# EAGLE schematic Amplifier+Mixer (EAGLE 9.3.0)
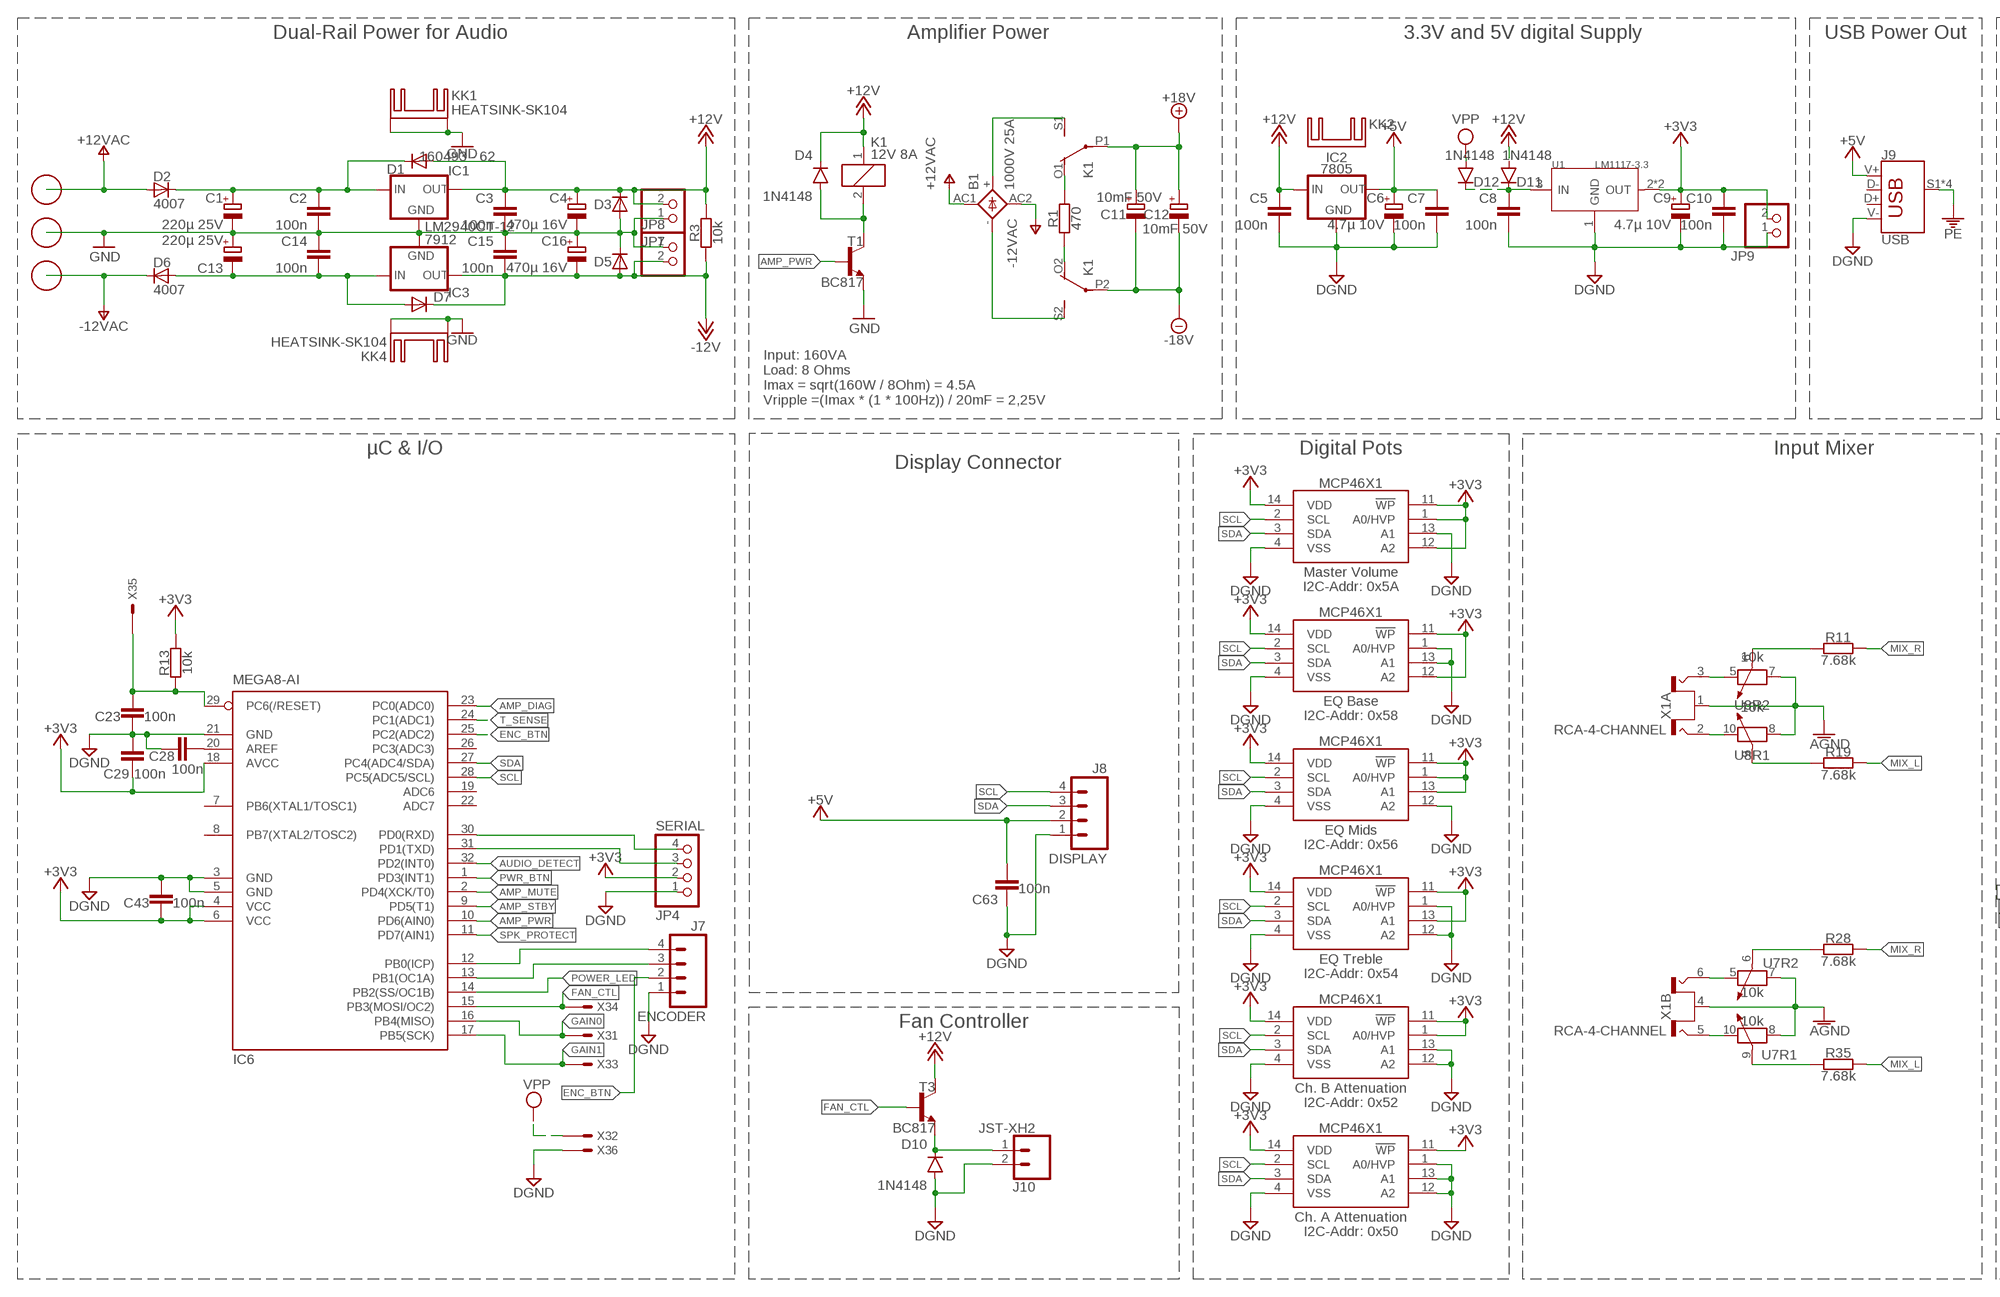
[diagram p0: schematic, sheet 1, part 1 of 2]
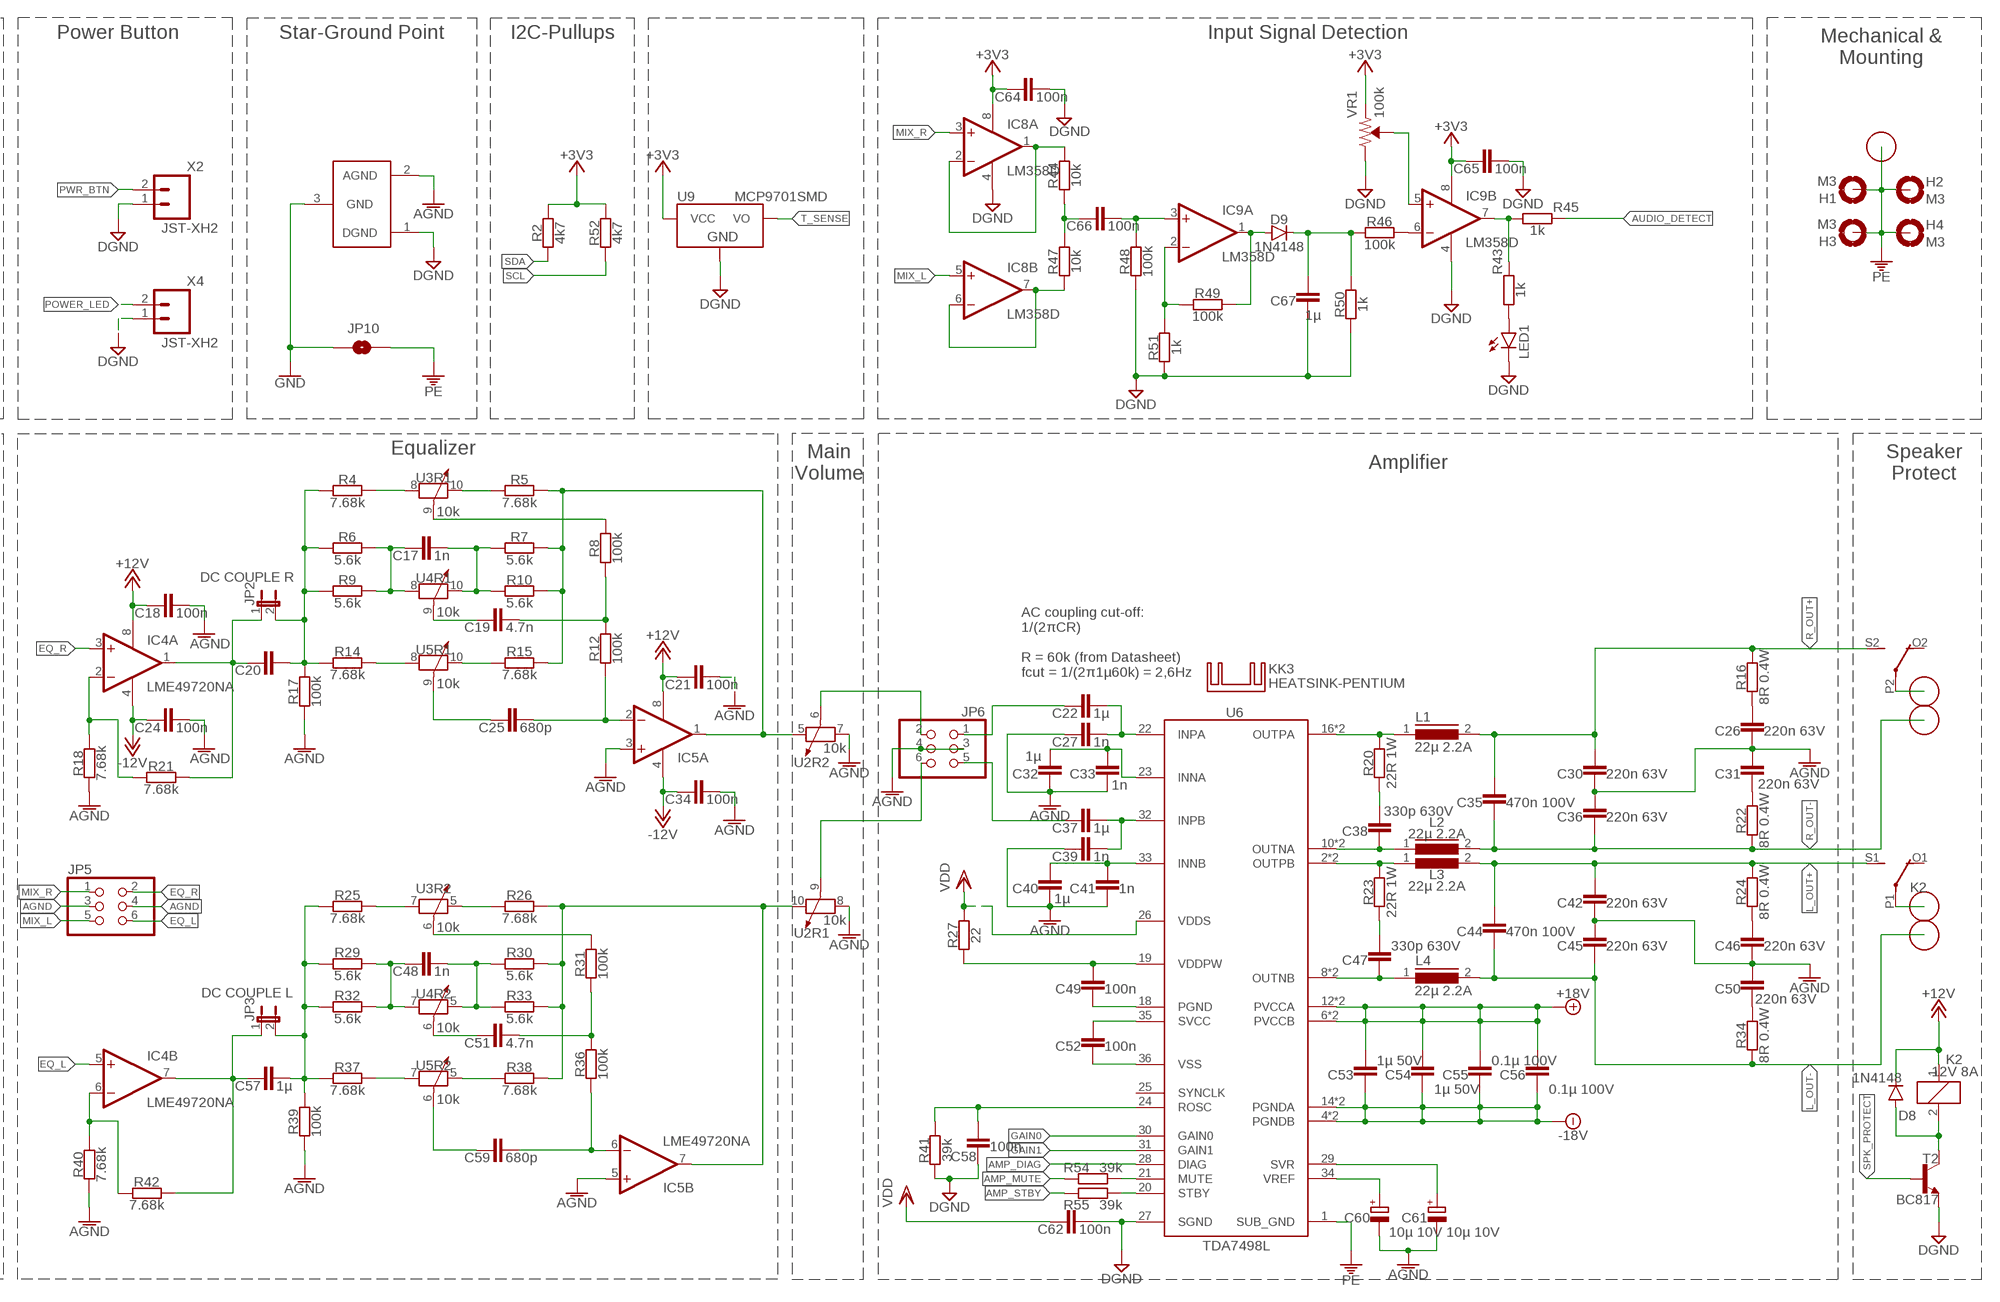
[diagram p1: schematic, sheet 1, part 2 of 2]

## Parts
B1  1000V 25A  RECTIFIER-FB100  [FB100]
C1  220µ 25V  CPOL-EU175TMP-0810  [175TMP-0810]
C2  100n  C-EUC0603  [C0603]
C3  100n  C-EUC0603  [C0603]
C4  470µ 16V  CPOL-EU175TMP-0810  [175TMP-0810]
C5  100n  C-EUC0603  [C0603]
C6  4.7µ 10V  CPOL-EU153CLV-0505  [153CLV-0505]
C7  100n  C-EUC0603  [C0603]
C8  100n  C-EUC0603  [C0603]
C9  4.7µ 10V  CPOL-EU153CLV-0505  [153CLV-0505]
C10  100n  C-EUC0603  [C0603]
C11  10mF 50V  TEAPO-SLG109M050S1A5T  [EB35D]
C12  10mF 50V  TEAPO-SLG109M050S1A5T  [EB35D]
C13  220µ 25V  CPOL-EU175TMP-0810  [175TMP-0810]
C14  100n  C-EUC0603  [C0603]
C15  100n  C-EUC0603  [C0603]
C16  470µ 16V  CPOL-EU175TMP-0810  [175TMP-0810]
C17  1n  C-EU050-025X075  [C050-025X075]
C18  100n  C-EUC0603  [C0603]
C19  4.7n  C-EU075-032X103  [C075-032X103]
C20  DC COUPLE L  C-EU050-050X075  [C050-050X075]
C21  100n  C-EUC0603  [C0603]
C22  1µ  C-EU050-050X075  [C050-050X075]
C23  100n  C-EUC0603  [C0603]
C24  100n  C-EUC0603  [C0603]
C25  680p  C-EU050-045X075  [C050-045X075]
C26  220n 63V  C-EU050-025X075  [C050-025X075]
C27  1n  C-EU050-025X075  [C050-025X075]
C28  100n  C-EUC0603  [C0603]
C29  100n  C-EUC0603  [C0603]
C30  220n 63V  C-EU050-025X075  [C050-025X075]
C31  220n 63V  C-EU050-025X075  [C050-025X075]
C32  1µ  C-EU050-050X075  [C050-050X075]
C33  1n  C-EU050-025X075  [C050-025X075]
C34  100n  C-EUC0603  [C0603]
C35  470n 100V  C-EU050-045X075  [C050-045X075]
C36  220n 63V  C-EU050-025X075  [C050-025X075]
C37  1µ  C-EU050-050X075  [C050-050X075]
C38  330p 630V  C-EU050-045X075  [C050-045X075]
C39  1n  C-EU050-025X075  [C050-025X075]
C40  1µ  C-EU050-050X075  [C050-050X075]
C41  1n  C-EU050-025X075  [C050-025X075]
C42  220n 63V  C-EU050-025X075  [C050-025X075]
C43  100n  C-EUC0603  [C0603]
C44  470n 100V  C-EU050-045X075  [C050-045X075]
C45  220n 63V  C-EU050-025X075  [C050-025X075]
C46  220n 63V  C-EU050-025X075  [C050-025X075]
C47  330p 630V  C-EU050-045X075  [C050-045X075]
C48  1n  C-EU050-025X075  [C050-025X075]
C49  100n  C-EUC0603  [C0603]
C50  220n 63V  C-EU050-025X075  [C050-025X075]
C51  4.7n  C-EU075-032X103  [C075-032X103]
C52  100n  C-EUC0603  [C0603]
C53  1µ 50V  C-EUC1206K  [C1206K]
C54  1µ 50V  C-EUC1206K  [C1206K]
C55  0.1µ 100V  C-EUC1206K  [C1206K]
C56  0.1µ 100V  C-EUC1206K  [C1206K]
C57  1µ  C-EU050-050X075  [C050-050X075]
C58  100n  C-EUC0603  [C0603]
C59  680p  C-EU050-045X075  [C050-045X075]
C60  10µ 10V  CPOL-EU153CLV-0505  [153CLV-0505]
C61  10µ 10V  CPOL-EU153CLV-0505  [153CLV-0505]
C62  100n  C-EUC0603  [C0603]
C63  100n  C-EUC0603  [C0603]
C64  100n  C-EUC0603  [C0603]
C65  100n  C-EUC0603  [C0603]
C66  100n  C-EUC0603  [C0603]
C67  1µ  C-EUC0603  [C0603]
D1  4007  DIODE  [SODFL5024X231]
D2  4007  DIODE  [SODFL5024X231]
D3  4007  DIODE  [SODFL5024X231]
D4  1N4148  DIODEBAS16  [SOD-323]
D5  4007  DIODE  [SODFL5024X231]
D6  4007  DIODE  [SODFL5024X231]
D7  4007  DIODE  [SODFL5024X231]
D8  1N4148  DIODEBAS16  [SOD-323]
D9  1N4148  DIODEBAS16  [SOD-323]
D10  1N4148  DIODEBAS16  [SOD-323]
D11  1N4148  DIODEBAS16  [SOD-323]
D12  1N4148  DIODEBAS16  [SOD-323]
H1  M3  HOLE-3MM-PAD  [3,0-PAD]
H2  M3  HOLE-3MM-PAD  [3,0-PAD]
H3  M3  HOLE-3MM-PAD  [3,0-PAD]
H4  M3  HOLE-3MM-PAD  [3,0-PAD]
IC1  LM2940CT-12  78XXS  [78XXS]
IC2  7805  78XXS  [78XXS]
IC3  7912  79XXS  [79XXS]
IC4  LME49720NA  LM358N  [DIL08]
IC5  LME49720NA  LM358N  [DIL08]
IC6  MEGA8-AI  [TQFP32-08]
IC8  LM358D  2AMP_P8+4D  [SO08]
IC9  LM358D  2AMP_P8+4D  [SO08]
J1  6MM  TERMINAL-1  [TE-726386]
J2  6MM  TERMINAL-1  [TE-726386]
J3  6MM  TERMINAL-1  [TE-726386]
J4  6MM  TERMINAL-1  [TE-726386]
J5  TERMINAL-BLOCK-2PLUG-IN  [MSTBV2]
J6  TERMINAL-BLOCK-2PLUG-IN  [MSTBV2]
J7  ENCODER  JST-XH4  [JST-4-PTH-VERT]
J8  DISPLAY  JST-XH4  [JST-4-PTH-VERT]
J9  USB  [ECON-USBBUVA]
J10  JST-XH2  [JST-2-PTH-VERT]
JP1  GND_CONNECT  [GND_CONNECT]
JP2  DC COULE R  JP1E  [JP1]
JP3  DC COUPLE L  JP1E  [JP1]
JP4  SERIAL  PINHD-1X4  [1X04]
JP5  MIX OUT  PINHD-2X3  [2X03]
JP6  PREAMP OUT  PINHD-2X3  [2X03]
JP7  PINHD-1X2  [1X02]
JP8  PINHD-1X2  [1X02]
JP9  PINHD-1X2  [1X02]
JP10  PEGND  JUMPER-SMT_2_NO_NO-SILK  [SMT-JUMPER_2_NO_NO-SILK]
K1  12V 8A  RELAY-F40.52  [F4052]
K2  12V 8A  RELAY-F40.52  [F4052]
KK1  HEATSINK-SK104  [SK104-PAD]
KK2  HEATSINK-SK95  [SK95-2M3]
KK3  HEATSINK-PENTIUM  [HEATSINK-PENTIUM]
KK4  HEATSINK-SK104  [SK104-PAD]
L1  22µ 2.2A  INDUCTOR12MM-SMD  [INDUCTOR-12MM]
L2  22µ 2.2A  INDUCTOR12MM-SMD  [INDUCTOR-12MM]
L3  22µ 2.2A  INDUCTOR12MM-SMD  [INDUCTOR-12MM]
L4  22µ 2.2A  INDUCTOR12MM-SMD  [INDUCTOR-12MM]
LED1  LEDCHIP-LED0603  [CHIP-LED0603]
R1  470  RESISTOR-0617-22  [0617/22]
R2  4k7  R-EU_R0603  [R0603]
R3  10k  R-EU_R0603  [R0603]
R4  7.68k  R-EU_MELF0207W  [MINI_MELF-0207W]
R5  7.68k  R-EU_MELF0207W  [MINI_MELF-0207W]
R6  5.6k  R-EU_MELF0207W  [MINI_MELF-0207W]
R7  5.6k  R-EU_MELF0207W  [MINI_MELF-0207W]
R8  100k  R-EU_MELF0204W  [MINI_MELF-0204W]
R9  5.6k  R-EU_MELF0207W  [MINI_MELF-0207W]
R10  5.6k  R-EU_MELF0207W  [MINI_MELF-0207W]
R11  7.68k  R-EU_MELF0207W  [MINI_MELF-0207W]
R12  100k  R-EU_MELF0204W  [MINI_MELF-0204W]
R13  10k  R-EU_R0603  [R0603]
R14  7.68k  R-EU_MELF0207W  [MINI_MELF-0207W]
R15  7.68k  R-EU_MELF0207W  [MINI_MELF-0207W]
R16  8R 0.4W  R-EU_MELF0204W  [MINI_MELF-0204W]
R17  100k  R-EU_MELF0204W  [MINI_MELF-0204W]
R18  7.68k  R-EU_MELF0207W  [MINI_MELF-0207W]
R19  7.68k  R-EU_MELF0207W  [MINI_MELF-0207W]
R20  22R 1W  R-EU_MELF0207W  [MINI_MELF-0207W]
R21  7.68k  R-EU_MELF0207W  [MINI_MELF-0207W]
R22  8R 0.4W  R-EU_MELF0204W  [MINI_MELF-0204W]
R23  22R 1W  R-EU_MELF0207W  [MINI_MELF-0207W]
R24  8R 0.4W  R-EU_MELF0204W  [MINI_MELF-0204W]
R25  7.68k  R-EU_MELF0207W  [MINI_MELF-0207W]
R26  7.68k  R-EU_MELF0207W  [MINI_MELF-0207W]
R27  22  R-EU_R0603  [R0603]
R28  7.68k  R-EU_MELF0207W  [MINI_MELF-0207W]
R29  5.6k  R-EU_MELF0207W  [MINI_MELF-0207W]
R30  5.6k  R-EU_MELF0207W  [MINI_MELF-0207W]
R31  100k  R-EU_MELF0204W  [MINI_MELF-0204W]
R32  5.6k  R-EU_MELF0207W  [MINI_MELF-0207W]
R33  5.6k  R-EU_MELF0207W  [MINI_MELF-0207W]
R34  8R 0.4W  R-EU_MELF0204W  [MINI_MELF-0204W]
R35  7.68k  R-EU_MELF0207W  [MINI_MELF-0207W]
R36  100k  R-EU_MELF0204W  [MINI_MELF-0204W]
R37  7.68k  R-EU_MELF0207W  [MINI_MELF-0207W]
R38  7.68k  R-EU_MELF0207W  [MINI_MELF-0207W]
R39  100k  R-EU_MELF0204W  [MINI_MELF-0204W]
R40  7.68k  R-EU_MELF0207W  [MINI_MELF-0207W]
R41  39k  R-EU_R0603  [R0603]
R42  7.68k  R-EU_MELF0207W  [MINI_MELF-0207W]
R43  1k  R-EU_R0603  [R0603]
R44  10k  R-EU_R0603  [R0603]
R45  1k  R-EU_R0603  [R0603]
R46  100k  R-EU_R0603  [R0603]
R47  10k  R-EU_R0603  [R0603]
R48  100k  R-EU_R0603  [R0603]
R49  100k  R-EU_R0603  [R0603]
R50  1k  R-EU_R0603  [R0603]
R51  1k  R-EU_R0603  [R0603]
R52  4k7  R-EU_R0603  [R0603]
R54  39k  R-EU_R0603  [R0603]
R55  39k  R-EU_R0603  [R0603]
T1  BC817  BC817-16-NPN-SOT23-BEC  [SOT23-BEC]
T2  BC817  BC817-16-NPN-SOT23-BEC  [SOT23-BEC]
T3  BC817  BC817-16-NPN-SOT23-BEC  [SOT23-BEC]
U1  LM1117-3.3  PMIC-CJT1117-3.3(SOT223)  [SOT-223]
U2  10k  MCP46X1  [SOP65P640X120-14]
U3  10k  MCP46X1  [SOP65P640X120-14]
U4  10k  MCP46X1  [SOP65P640X120-14]
U5  10k  MCP46X1  [SOP65P640X120-14]
U6  TDA7498L  [SOP50P1010X245-36]
U7  10k  MCP46X1  [SOP65P640X120-14]
U8  10k  MCP46X1  [SOP65P640X120-14]
U9  MCP9701SMD  MCP9700SMD  [SOT23-3]
VR1  100k  TRIMPOT-SMD-3MM-OPEN-1/10W-25%  [TRIMPOT-SMD-TC33X]
X1  RCA-4-CHANNEL  [BKL-072385]
X2  JST-XH2  [JST-2-PTH-VERT]
X3  ICSP  CONN-IDC-6  [057-006-1]
X4  JST-XH2  [JST-2-PTH-VERT]

## Nets
+3V3: C9.+ C10.1 C29.1 C43.1 C64.1 C65.1 IC6.4(VCC) IC6.6(VCC) IC6.18(AVCC) IC8.8(P:V+) IC9.8(P:V+) JP4.2 JP9.2 R2.2 R13.2 R52.2 U1.2(OUT) U1.TER(OUT) U2.1(A0/HVP) U2.11(!WP) U2.12(A2) U2.14(VDD) U3.11(!WP) U3.12(A2) U3.14(VDD) U4.1(A0/HVP) U4.11(!WP) U4.13(A1) U4.14(VDD) U5.11(!WP) U5.13(A1) U5.14(VDD) U7.1(A0/HVP) U7.11(!WP) U7.14(VDD) U8.11(!WP) U8.14(VDD) U9.1(VCC) VR1.3(CCW)
+5V: C6.+ C7.1 C63.2 IC2.OUT J8.2 J9.V+(VBUS)
+12V: C3.1 C4.+ C5.1 C18.1 C21.1 D1.A D3.C D4.C D8.C D11.A IC1.OUT IC2.IN IC4.8(P:V+) IC5.8(P:V+) JP7.2 K1.1 K2.1 R3.1 T3.C
+18V: C11.+ C12.+ C53.1 C54.1 C55.1 C56.1 K1.P1(SW1:P) U6.6(PVCCB) U6.7(PVCCB) U6.12(PVCCA) U6.13(PVCCA)
-12V: C15.2 C16.- C24.1 C34.1 D5.A D7.C IC3.OUT IC4.4(P:V-) IC5.4(P:V-) JP8.2 R3.2
-18V: C11.- C12.- C53.2 C54.2 C55.2 C56.2 K1.P2(SW2:P) U6.4(PGNDB) U6.5(PGNDB) U6.14(PGNDA) U6.15(PGNDA)
AGND: C18.2 C21.2 C24.2 C26.2 C27.1 C30.2 C31.1 C32.1 C33.1 C34.2 C36.1 C39.1 C40.1 C41.1 C42.2 C45.1 C46.2 C50.1 C60.- C61.- IC5.3(A:+IN) IC5.5(B:+IN) JP1.2(AGND) JP5.3 JP5.4 JP6.3 JP6.4 R17.1 R18.2 R39.1 R40.2 U2.7(R2:A) U2.8(R1:A) U7.7(R2:A) U7.8(R1:A) U8.7(R2:A) U8.8(R1:A) X1.1(A:S) X1.4(B:S)
AMP_DIAG: IC6.23(PC0(ADC0)) U6.28(DIAG)
AMP_MUTE: IC6.2(PD4(XCK/T0)) R54.2
AMP_MUTE_CL: R54.1 U6.21(MUTE)
AMP_PWR: IC6.10(PD6(AIN0)) T1.B
AMP_STBY: IC6.9(PD5(T1)) R55.2
AMP_STBY_CL: R55.1 U6.20(STBY)
AUDIO_DETECT: IC6.32(PD2(INT0)) R45.1
DGND: C5.2 C6.- C7.2 C8.2 C9.- C10.2 C23.1 C28.2 C29.2 C43.2 C58.2 C62.1 C63.1 C64.2 C65.2 C67.1 D10.A IC2.GND IC6.3(GND) IC6.5(GND) IC6.21(GND) IC8.4(P:V-) IC9.4(P:V-) J7.1 J8.1 J9.V-(GND) J10.2 JP1.1(DGND) JP4.1 JP9.1 LED1.C R41.1 R48.1 R50.1 R51.1 T2.E U1.1(GND) U2.4(VSS) U2.13(A1) U3.1(A0/HVP) U3.4(VSS) U3.13(A1) U4.4(VSS) U4.12(A2) U5.1(A0/HVP) U5.4(VSS) U5.12(A2) U6.27(SGND) U7.4(VSS) U7.12(A2) U7.13(A1) U8.1(A0/HVP) U8.4(VSS) U8.12(A2) U8.13(A1) U9.3(GND) VR1.1(CW) X2.1 X3.6 X4.1
ENC_BTN: IC6.25(PC2(ADC2)) J7.2
EQ_L: IC4.5(B:+IN) JP5.6
EQ_OUT_L: IC5.7(B:OUT) R26.1 R30.1 R33.1 R38.1 U2.10(R1:B)
EQ_OUT_R: IC5.1(A:OUT) R5.1 R7.1 R10.1 R15.1 U2.5(R2:B)
EQ_R: IC4.3(A:+IN) JP5.2
FAN_CTL: IC6.15(PB3(MOSI/OC2)) T3.B X3.4
GAIN0: IC6.16(PB4(MISO)) U6.30(GAIN0) X3.1
GAIN1: IC6.17(PB5(SCK)) U6.31(GAIN1) X3.3
GND: C1.- C2.2 C3.2 C4.- C13.+ C14.1 C15.1 C16.+ D3.A D5.C IC1.GND IC3.GND J2.P$1 J2.P$2 JP1.3(GND) JP7.1 JP8.1 JP10.1 KK1.K1(K) KK1.K2(K) KK4.K1(K) KK4.K2(K) T1.E
INNA: C32.2 C33.2 U6.23(INNA)
INNB: C40.2 C41.2 U6.33(INNB)
INPA: C22.2 C27.2 U6.22(INPA)
INPB: C37.2 C39.2 U6.32(INPB)
L_OUT+: C42.1 C44.1 K2.S1(SW1:S) L3.2 R24.2
L_OUT-: C44.2 C45.2 J6.1 L4.2 R34.1
MIX_AMP_L: C57.1 IC4.7(B:OUT) JP3.1 R42.1
MIX_AMP_R: C20.1 IC4.1(A:OUT) JP2.1 R21.1
MIX_L: IC8.5(B:+IN) JP5.5 R19.2 R35.2
MIX_R: IC8.3(A:+IN) JP5.1 R11.2 R28.2
N$1: C20.2 JP2.2 R4.2 R6.2 R9.2 R14.2 R17.2
N$2: R14.1 U5.8(R1:A)
N$3: C25.2 U5.9(R1:W)
N$4: R15.2 U5.10(R1:B)
N$5: C17.1 R6.1 R9.1 U4.8(R1:A)
N$6: C57.2 JP3.2 R25.2 R29.2 R32.2 R37.2 R39.2
N$7: R8.2 U3.9(R1:W)
N$8: R31.2 U3.6(R2:W)
N$9: B1.+ K1.S1(SW1:S)
N$10: R26.2 U3.5(R2:B)
N$11: C19.2 U4.9(R1:W)
N$12: C19.1 R8.1 R12.2
N$13: C66.1 R44.1 R47.2
N$14: R25.1 U3.7(R2:A)
N$15: C17.2 R7.2 R10.2 U4.10(R1:B)
N$16: C59.2 U5.6(R2:W)
N$17: C51.2 U4.6(R2:W)
N$18: R4.1 U3.8(R1:A)
N$19: C48.1 R29.1 R32.1 U4.7(R2:A)
N$20: C48.2 R30.2 R33.2 U4.5(R2:B)
N$21: R37.1 U5.7(R2:A)
N$22: R38.2 U5.5(R2:B)
N$23: C13.- C14.2 D6.A D7.A IC3.IN
N$24: C1.+ C2.1 D1.C D2.C IC1.IN
N$25: C66.2 IC9.3(A:+IN) R48.2
N$26: C52.2 U6.36(VSS)
N$27: B1.- K1.S2(SW2:S)
N$28: R5.2 U3.10(R1:B)
N$29: C51.1 R31.1 R36.2
N$30: C52.1 U6.35(SVCC)
N$31: IC9.2(A:-IN) R49.2 R51.2
N$32: D9.A IC9.1(A:OUT) R49.1
N$33: C67.2 D9.C R46.2 R50.2
N$34: IC9.6(B:-IN) R46.1
N$35: IC9.5(B:+IN) VR1.2(WIPER)
N$36: IC9.7(B:OUT) R43.1 R45.2
N$37: LED1.A R43.2
N$38: IC8.6(B:-IN) IC8.7(B:OUT) R47.1
N$39: IC8.1(A:OUT) IC8.2(A:-IN) R44.2
N$40: U7.5(R2:B) X1.6(B:T2)
N$41: U7.10(R1:B) X1.5(B:T1)
N$42: R35.1 U7.9(R1:W)
N$43: R28.1 U7.6(R2:W)
N$44: IC4.6(B:-IN) R40.1 R42.2
N$45: IC4.2(A:-IN) R18.1 R21.2
N$46: U8.5(R2:B) X1.3(A:T2)
N$47: U8.10(R1:B) X1.2(A:T1)
N$48: R19.1 U8.9(R1:W)
N$49: R11.1 U8.6(R2:W)
N$50: D4.A K1.2 T1.C
N$51: J6.2 K2.P1(SW1:P)
N$53: K1.O1(SW1:O) R1.1
N$54: C58.1 R41.2 U6.24(ROSC)
N$55: C49.1 R27.1 U6.19(VDDPW)
N$56: C49.2 U6.18(PGND)
N$57: C8.1 D11.C D12.C U1.3(IN)
N$59: K1.O2(SW2:O) R1.2
N$61: J5.1 K2.P2(SW2:P)
N$62: C50.2 R34.2
N$63: D10.C J10.1 T3.E
N$64: C46.1 R24.1
N$65: C60.+ U6.34(VREF)
N$66: C61.+ U6.29(SVR)
N$67: C31.2 R22.2
N$68: C26.1 R16.1
N$69: C47.2 L4.1 U6.8(OUTNB) U6.9(OUTNB)
N$70: C38.2 L2.1 U6.10(OUTNA) U6.11(OUTNA)
N$71: C38.1 R20.1
N$72: C47.1 R23.1
N$73: L1.1 R20.2 U6.16(OUTPA) U6.17(OUTPA)
N$74: L3.1 R23.2 U6.2(OUTPB) U6.3(OUTPB)
N$75: D8.A K2.2 T2.C
N$76: IC6.13(PB1(OC1A)) J7.3
N$77: C28.1 IC6.20(AREF)
N$78: IC6.12(PB0(ICP)) J7.4
N$81: C22.1 JP6.1
N$82: C23.2 IC6.29(PC6(/RESET)) R13.1 X3.5
N$84: C37.1 JP6.5
N$85: IC6.30(PD0(RXD)) JP4.4
N$86: IC6.31(PD1(TXD)) JP4.3
OUT_L_DAMPED: C59.1 IC5.6(B:-IN) R36.1
OUT_R_DAMPED: C25.1 IC5.2(A:-IN) R12.1
PE: H1.B3,0(MOUNT) H2.B3,0(MOUNT) H3.B3,0(MOUNT) H4.B3,0(MOUNT) J4.P$1 J4.P$2 J9.S1(SHIELD) J9.S2(SHIELD) J9.S3(SHIELD) J9.S4(SHIELD) JP10.2 U6.1(SUB_GND)
POWER_LED: IC6.14(PB2(SS/OC1B)) X4.2
PREAMP_OUT_L: JP6.6 U2.9(R1:W)
PREAMP_OUT_R: JP6.2 U2.6(R2:W)
PWR_BTN: IC6.1(PD3(INT1)) X2.2
R_OUT+: C30.1 C35.1 K2.S2(SW2:S) L1.2 R16.2
R_OUT-: C35.2 C36.2 J5.2 L2.2 R22.1
SCL: IC6.28(PC5(ADC5/SCL)) J8.4 R52.1 U2.2(SCL) U3.2(SCL) U4.2(SCL) U5.2(SCL) U7.2(SCL) U8.2(SCL)
SDA: IC6.27(PC4(ADC4/SDA)) J8.3 R2.1 U2.3(SDA) U3.3(SDA) U4.3(SDA) U5.3(SDA) U7.3(SDA) U8.3(SDA)
SPK_PROTECT: IC6.11(PD7(AIN1)) T2.B
T_SENSE: IC6.24(PC1(ADC1)) U9.2(VO)
V+: B1.AC1 D2.A J1.P$1 J1.P$2 ; supply symbol labelled +12VAC
V-: B1.AC2 D6.C J3.P$1 J3.P$2 ; supply symbol labelled -12VAC
VDD: C62.2 R27.2 U6.26(VDDS)
VPP: D12.A X3.2
Unconnected: IC6.7(PB6(XTAL1/TOSC1)) IC6.8(PB7(XTAL2/TOSC2)) IC6.19(ADC6) IC6.22(ADC7) IC6.26(PC3(ADC3)) J9.D+ J9.D- K2.O1(SW1:O) K2.O2(SW2:O) U6.25(SYNCLK)

## Notes on the sheet
- Dual-Rail Power for Audio | Amplifier Power | 3.3V and 5V digital Supply | USB Power Out | Power Button | Star-Ground Point | I2C-Pullups | Input Signal Detection
- Mechanical &
  Mounting
- Input: 160VA
  Load: 8 Ohms
  Imax = sqrt(160W / 8Ohm) = 4.5A
  Vripple =(Imax * (1 * 100Hz)) / 20mF = 2,25V
- µC & I/O | Digital Pots | Input Mixer | Equalizer
- Display Connector
- Main
  Volume
- Amplifier
- Speaker
  Protect
- Master Volume | DC COUPLE R
- I2C-Addr: 0x5A
- AC coupling cut-off:
  1/(2πCR)
  
  R = 60k (from Datasheet)
  fcut = 1/(2π1µ60k) = 2,6Hz
- EQ Base
- I2C-Addr: 0x58
- EQ Mids
- I2C-Addr: 0x56
- EQ Treble
- I2C-Addr: 0x54
- DC COUPLE L
- Fan Controller
- Ch. B Attenuation
- I2C-Addr: 0x52
- Ch. A Attenuation
- I2C-Addr: 0x50

## Library data of the parts
B1 = Class D Amp:RECTIFIER-FB100; CONRAD: 1582009 - 62; MOUSER: 833-GBJL2510-BP; SPEC: TC-GBI25M; STOCK: 0
C1 C13 = rcl:CPOL-EU: POLARIZED CAPACITOR, European symbol; CONRAD: 404629 - 62; MOUSER: 647-UWT1E221MNL1GS; SPICEPREFIX: C; STOCK: 2
C2 C3 C5 C7 C8 C10 C14 C15 C18 C21 C23 C24 C28 C29 C34 C43 C49 C52 C58 C62-C66 = rcl:C-EU: CAPACITOR, European symbol; CONRAD: 457901 - 62; MOUSER: 710-885012206071; SPICEPREFIX: C; STOCK: 24
C4 C16 = rcl:CPOL-EU: POLARIZED CAPACITOR, European symbol; CONRAD: 404626 - 62; MOUSER: 647-UWT1C471MNL1S; SPICEPREFIX: C; STOCK: 2
C6 C9 = rcl:CPOL-EU: POLARIZED CAPACITOR, European symbol; CONRAD: 1280266 - 62; MOUSER: 710-865230642008; SPICEPREFIX: C; STOCK: 2
C11 C12 = Class D Amp:TEAPO-SLG109M050S1A5T; CONRAD: 1325816 - 62; MOUSER: 647-LLS1H103MELC; SPEC: Teapo SLG109M050S1A5T40K; STOCK: 0
C17 C27 C33 C39 C41 C48 = rcl:C-EU: CAPACITOR, European symbol; CONRAD: 1235242 - 62; MOUSER: 80-R82EC1100AA50K; SPEC: Kemet R82EC1100AA50K+; SPICEPREFIX: C; STOCK: 0
C19 C51 = rcl:C-EU: CAPACITOR, European symbol; CONRAD: 459871 - 62; MOUSER: 594-222237188472; SPEC: Wima FKS3D014702B00KSSD; SPICEPREFIX: C; STOCK: 0
C20 C22 C32 C37 C40 C57 = rcl:C-EU: CAPACITOR, European symbol; CONRAD: 1235274 - 62; MOUSER: 80-R82DC4100AA60K; SPEC: Kemet R82DC4100AA60K+; SPICEPREFIX: C; STOCK: 0
C25 C59 = rcl:C-EU: CAPACITOR, European symbol; CONRAD: 450548 - 62; MOUSER: 505-FKP2J006801D00KS; SPEC: Wima FKP2J006801D00HSSD; SPICEPREFIX: C; STOCK: 0
C26 C30 C31 C36 C42 C45 C46 C50 = rcl:C-EU: CAPACITOR, European symbol; CONRAD: 1235241 - 62; MOUSER: 80-R82DC3220AA60K; SPEC: Kemet R82DC3220AA60K+; SPICEPREFIX: C; STOCK: 0
C35 C44 = rcl:C-EU: CAPACITOR, European symbol; CONRAD: 459945 - 62; MOUSER: 505-MKS2D034701E00JI; SPEC: Wima MKS2D034701E00KSSD; SPICEPREFIX: C; STOCK: 0
C38 C47 = rcl:C-EU: CAPACITOR, European symbol; CONRAD: 450521 - 62; MOUSER: 505-FKP2C003301D00KI; SPEC: Wima FKP2J003301D00HSSD; SPICEPREFIX: C; STOCK: 0
C53 C54 = rcl:C-EU: CAPACITOR, European symbol; CONRAD: 1279028 - 62; MOUSER: 80-C1206C105M5RECLR; SPICEPREFIX: Kemet C1206C105K5RAC7800+; STOCK: 0
C55 C56 = rcl:C-EU: CAPACITOR, European symbol; CONRAD: 458125 - 62; MOUSER: 77-VJ1206Y104KXBAT; SPICEPREFIX: Kemet C1206C104K1RAC7800+; STOCK: 0
C60 C61 = rcl:CPOL-EU: POLARIZED CAPACITOR, European symbol; CONRAD: 421520 - 6; MOUSER: 710-865080642006; SPICEPREFIX: C; STOCK: 0
C67 = rcl:C-EU: CAPACITOR, European symbol; CONRAD: 457913 - 62; MOUSER: 710-885012106022; SPICEPREFIX: C; STOCK: 1
D1-D3 D5-D7 = Parts:DIODE; CONRAD: 160493 - 62; MOUSER: 583-FM4007W-W; SPEC: 4007; STOCK: 6
D4 D8-D12 = SparkFun-DiscreteSemi:DIODE: Diode These are standard reverse protection diodes and small signal diodes. SMA package can handle up to about 1A. SOD-323 can handle about 200mA. What the SOD-323 package when ordering, there are some mfgs out there that are 5-pin packages.; CONRAD: 1582023 - 62; MOUSER: 512-1N4148WS; PROD_ID: DIO-09646; STOCK: 4; VALUE: 250mA/100V
H1-H4 = Class D Amp:HOLE-3MM-PAD; STOCK: 4
IC1 = v-reg:78XXS: VOLTAGE REGULATOR; CONRAD: 1013996 - 62; MOUSER: 511-L7812CV; STOCK: 1
IC2 = v-reg:78XXS: VOLTAGE REGULATOR; CONRAD: 179205 - 62; MOUSER: 511-L7805CV; STOCK: 1
IC3 = v-reg:79XXS: VOLTAGE REGULATOR; CONRAD: 156077 - 62; MOUSER: 511-L7912CV; STOCK: 1
IC4 IC5 = linear:LM358: OP AMP also LM158; LM258; LM2904 Source: http://cache.national.com/ds/LM/LM158.pdf; CONRAD: 1010937 - 62; STOCK: 0
IC6 = atmel:MEGA8: MICROCONTROLLER 8 Kbytes FLASH, 1 kbytes SRAM, 512 bytes EEPROM, USART, 6-channel 10 bit ADC, 2-channel 8 bit ADC Pin compatible with Atmega48, ATMega88, ATMega168 Source: avr.lbr; CONRAD: 155196 - 62; MOUSER: 556-ATMEGA328-AU; MPN: ATMEGA8-16AU; STOCK: 1
IC8 IC9 = linear:2AMP_P8+4: OP AMP; CONRAD: 1010764 - 62; MOUSER: 511-LM358DT; STOCK: 2
J1-J4 = AdapterBoard:TERMINAL-1; CONRAD: 808428 - 62; MOUSER: 571-726386-2; STOCK: 2
J5 J6 = AdapterBoard:TERMINAL-BLOCK-2; CONRAD: 1327203 - 62; MOUSER: 651-1954919; STOCK: 2
J7 J8 = Class D Amp:JST-XH4; CONRAD: 741206 - 62; MOUSER: 538-35312-0260; STOCK: 1
J9 = AdapterBoard:USB; CONRAD: 1311468 - 62; MOUSER: 523-GSB19110KEU; STOCK: 0
J10 X2 X4 = Class D Amp:JST-XH2; CONRAD: 741161 - 62; MOUSER: 575-3191010200006000; STOCK: 2
JP1 = Class D Amp:GND_CONNECT: Use to make a connection of multiple grounds in only one place.; STOCK: 1
JP2 JP3 = jumper:JP1E: JUMPER; CONRAD: 1560728 - 62; MOUSER: 200-TSW10223TS; STOCK: 2
JP4 = pinhead:PINHD-1X4: PIN HEADER; CONRAD: 1560647 - 62; MOUSER: 649-68001-204HLF; STOCK: 0
JP5 JP6 = pinhead:PINHD-2X3: PIN HEADER
JP7-JP9 = pinhead:PINHD-1X2: PIN HEADER
JP10 = SparkFun-Jumpers:JUMPER-SMT_2_NO: Normally open jumper This jumper has two pads in close proximity to each other. Apply solder to close the connection. Round pads are easier to solder for beginners, but are a lot larger. SparkFun Product that uses the round pads: SparkFun EL Sequencer <https://www.sparkfun.com/products/12781>
K1 K2 = Class D Amp:RELAY-F40.52; CONRAD: 629528 - 62; MOUSER: 655-RT424012; SPEC: Hongfa HF115F/012-2ZS4A; STOCK: 0
KK1 KK4 = Class D Amp:HEATSINK-SK104; CONRAD: 188093 - 62; MOUSER: 490-HSE-B20254-035H; STOCK: 2
KK2 = Class D Amp:HEATSINK-SK95; CONRAD: 188158 - 62; MOUSER: 490-HSE-B2111-038; STOCK: 1
KK3 = Class D Amp:HEATSINK-PENTIUM; STOCK: 1
L1-L4 = Class D Amp:INDUCTOR; CONRAD: 1589286 - 62; MOUSER: 710-744771220; SPEC: TRU COMPONENTS TC-PIS4720-220M203; STOCK: 0
LED1 = led:LED: LED OSRAM: - CHIPLED LG R971, LG N971, LY N971, LG Q971, LY Q971, LO R971, LY R971 LH N974, LH R974 LS Q976, LO Q976, LY Q976 LO Q996 - Hyper CHIPLED LW Q18S LB Q993, LB Q99A, LB R99A - SideLED LS A670, LO A670, LY A670, LG A670, LP A670 LB A673, LV A673, LT A673, LW A673 LH A674 LY A675 LS A676, LA A676, LO A676, LY A676, LW A676 LS A679, LY A679, LG A679 - Hyper Micro SIDELED® LS Y876, LA Y876, LO Y876, LY Y876 LT Y87S - SmartLED LW L88C, LW L88S LB L89C, LB L89S, LG L890 LS L89K, LO L89K, LY L89K LS L896, LA L896, LO L896, LY L896 - TOPLED LS T670, LO T670, LY T670, LG T670, LP T670 LSG T670, LSP T670, LSY T670, LOP T670, LYG T670 LG T671, LOG T671, LSG T671 LB T673, LV T673, LT T673, LW T673 LH T674 LS T676, LA T676, LO T676, LY T676, LB T676, LH T676, LSB T676, LW T676 LB T67C, LV T67C, LT T67C, LS T67K, LO T67K, LY T67K, LW E67C LS E67B, LA E67B, LO E67B, LY E67B, LB E67C, LV E67C, LT E67C LW T67C LS T679, LY T679, LG T679 LS T770, LO T770, LY T770, LG T770, LP T770 LB T773, LV T773, LT T773, LW T773 LH T774 LS E675, LA E675, LY E675, LS T675 LS T776, LA T776, LO T776, LY T776, LB T776 LHGB T686 LT T68C, LB T68C - Hyper Mini TOPLED® LB M676 - Mini TOPLED Santana® LG M470 LS M47K, LO M47K, LY M47K Source: http://www.osram.convergy.de LUXEON: - LUMILED® LXK2-PW12-R00, LXK2-PW12-S00, LXK2-PW14-U00, LXK2-PW14-V00 LXK2-PM12-R00, LXK2-PM12-S00, LXK2-PM14-U00 LXK2-PE12-Q00, LXK2-PE12-R00, LXK2-PE12-S00, LXK2-PE14-T00, LXK2-PE14-U00 LXK2-PB12-K00, LXK2-PB12-L00, LXK2-PB12-M00, LXK2-PB14-N00, LXK2-PB14-P00, LXK2-PB14-Q00 LXK2-PR12-L00, LXK2-PR12-M00, LXK2-PR14-Q00, LXK2-PR14-R00 LXK2-PD12-Q00, LXK2-PD12-R00, LXK2-PD12-S00 LXK2-PH12-R00, LXK2-PH12-S00 LXK2-PL12-P00, LXK2-PL12-Q00, LXK2-PL12-R00 Source: www.luxeon.com KINGBRIGHT: KA-3528ASYC Source: www.kingbright.com
R1 = Class D Amp:RESISTOR-0617-22; CONRAD: 402095 - 62; MOUSER: 279-EP5WS470RJ; SPEC: Hochlast-Widerstand 470 Ω axial bedrahtet 5 W 5 % 1 St.; STOCK: 0
R2 R52 = rcl:R-EU_: RESISTOR, European symbol; CONRAD: 1585263 - 62; MOUSER: 603-AC0603JR-134K7L; SPICEPREFIX: R; STOCK: 2
R3 R13 R44 R47 = rcl:R-EU_: RESISTOR, European symbol; CONRAD: 1585269 - 62; MOUSER: 603-RC0603FR-0710KL; SPICEPREFIX: R; STOCK: 5
R4 R5 R11 R14 R15 R18 R19 R21 R25 R26 R28 R35 R37 R38 R40 R42 = rcl:R-EU_: RESISTOR, European symbol; CONRAD: 1621954 - 62; MOUSER: 71-SMM02070C7501FBP0; SPEC: Viking Tech CSRV0207FTDT7681; SPICEPREFIX: R; STOCK: 0
R6 R7 R9 R10 R29 R30 R32 R33 = rcl:R-EU_: RESISTOR, European symbol; CONRAD: 1621942 - AN; MOUSER: 71-SMM02070C5601FBP0; SPEC: Viking Tech CSRV0207FTDT5601; SPICEPREFIX: R; STOCK: 0
R8 R12 R17 R31 R36 R39 = rcl:R-EU_: RESISTOR, European symbol; CONRAD: 1621537 - 62; MOUSER: 756-WRM024HPC100KFT3; SPEC: Viking Tech CSRV0204FTDG1003; SPICEPREFIX: R; STOCK: 0
R16 R22 R24 R34 = rcl:R-EU_: RESISTOR, European symbol; CONRAD: 1621223 - 62; MOUSER: 756-WRM0204HPC8R2FT3; SPEC: Viking Tech CSRV0204FTDG7R68; SPICEPREFIX: R; STOCK: 0
R20 R23 = rcl:R-EU_: RESISTOR, European symbol; CONRAD: 1621763 - 62; MOUSER: 756-WRM0207HPC22RFT2; SPEC: Viking Tech CSRV0207FTDT0220; SPICEPREFIX: R; STOCK: 0
R27 = rcl:R-EU_: RESISTOR, European symbol; CONRAD: 1585778 - 62; MOUSER: 603-RC0603FR-0722RL; SPICEPREFIX: R; STOCK: 0
R41 = rcl:R-EU_: RESISTOR, European symbol; CONRAD: 1584631 - 62; MOUSER: 603-RC0603FR-0739KL; SPICEPREFIX: R; STOCK: 1
R43 R45 R50 R51 = rcl:R-EU_: RESISTOR, European symbol; CONRAD: 1585255 - 62; MOUSER: 603-RC0603FR-071KL; SPICEPREFIX: R; STOCK: 3
R46 R48 R49 R54 R55 = rcl:R-EU_: RESISTOR, European symbol; CONRAD: 1585286 - 62; MOUSER: 71-RCA0603100KJNEC; SPICEPREFIX: R; STOCK: 3
T1-T3 = transistor:*-NPN-: NPN Transistror BF959 corrected 2008.03.06; CONRAD: 1112873 - 62; MOUSER: 863-BC817-16LT3G; STOCK: 6
U1 = NixieClock:PMIC-CJT1117-3.3(SOT223): 310030097; CONRAD: 1261149 - 62; MOUSER: 926-LM1117MPX3.3NOPB; MPN: CJT1117-3.3; STOCK: 1; VALUE: CJT1117-3.3-SOT223
U2-U5 U7 U8 = Class D Amp:MCP46X1; CONRAD: 1083246 - 62; MOUSER: 579-MCP4641-103E/ST; STOCK: 6
U6 = Class D Amp:TDA7498L; CONRAD: 1184453 - 62; MOUSER: 511-TDA7498TR; STOCK: 0
U9 = SparkFun-Sensors:MCP9700: Analog-output temperature sensor; PROD_ID: IC-08917
VR1 = SparkFun-Resistors:TRIMPOT: Trimming Potentiometer (Trimpot) Three-terminal potentiometers, with an adjustable wiper and two adjustable resistors. A pot can be used to create a configurable voltage divider, or as a variable resistor. "Trimpots" are a subset of potentiometers, usually intended for "set-and-forget" applications. They're often more delicate than standard potentiometers - rated for fewer turns. Variants PTH-KNOB - PTH Trimpot w/ finger-adjustable knob Trimpot 10K with Knob <https://www.sparkfun.com/products/9806> (COM-09806) Datasheet <http://www.sparkfun.com/datasheets/Components/General/TSR-3386.pdf> SMD-3MM-CLOSED-FRAME - SMD 3mm Square Closed-Frame Trimpot Used on e.g. EasyDriver - Stepper Motor Driver <https://www.sparkfun.com/products/12779> Datasheet <http://www.bitechnologies.com/pdfs/22.pdf> (22AR10KTR) SMD-5MM - SMD 5mm Square Closed-Frame Trimpot Used on e.g. IOIO-OTG - V2.2 <https://www.sparkfun.com/products/13613> Datasheet <http://www.vishay.com/docs/51008/ts53.pdf> (TS53YL502MR10) SMD-3MM-1/10W-25% - 3mm Square Open-Frame Trimpot Used on e.g. SparkFun Shapeoko <https://www.sparkfun.com/products/13899> Datasheet <http://www.bourns.com/docs/Product-Datasheets/TC33.pdf> (TC33X-2-103E); CONRAD: 1618568 - 62; MOUSER: 858-35WR100KLFTR; PROD_ID: RES-12428; STOCK: 0; VALUE: 10k
X1 = Class D Amp:RCA-4-CHANNEL; CONRAD: 1578879 - 62; MOUSER: 806-KLP42X-61-WWRR; STOCK: 1
X3 = Class D Amp:CONN-IDC-6; CONRAD: 1560967 - 62; MOUSER: 200-TSW10307TD; STOCK: 1